# EAGLE design power_supply (EAGLE 9.6.2)
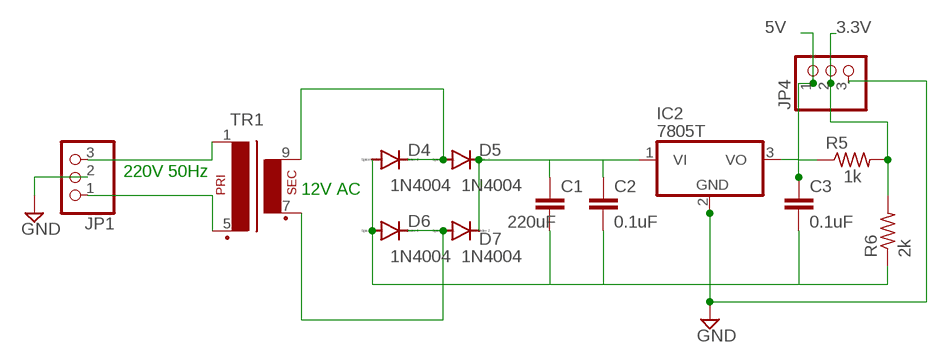
[diagram p0: schematic, sheet 1]

## Parts
C1  220uF  C-EU050-025X075  [C050-025X075]
C2  0.1uF  C-EU050-025X075  [C050-025X075]
C3  0.1uF  C-EU050-025X075  [C050-025X075]
D4  1N4004  [DO41-10]
D5  1N4004  [DO41-10]
D6  1N4004  [DO41-10]
D7  1N4004  [DO41-10]
IC2  7805T  [TO220H]
JP1  PINHD-1X3  [1X03]
JP4  PINHD-1X3  [1X03]
R5  1k  R-US_0207/10  [0207/10]
R6  2k  R-US_0207/10  [0207/10]
TR1  EI30-1  [EI30-1]

## Nets
3.3V: JP4.2 R5.2 R6.2
5V: C3.1 IC2.3(VO) JP4.1 R5.1
GND: C1.2 C2.2 C3.2 D4.A D6.A IC2.2(GND) JP1.2 JP4.3 R6.1
N$8: C1.1 C2.1 D5.C D7.C IC2.1(VI)
N$9: JP1.3 TR1.1
N$12: D4.C D5.A TR1.9(S4)
N$13: D6.C D7.A TR1.7(S3)
N$14: JP1.1 TR1.5(P2)

## Notes on the sheet
- 220V 50Hz
- 12V AC

## Library data of the parts
C1-C3 = rcl:C-EU: CAPACITOR, European symbol; SPICEPREFIX: C
D4-D7 = diode:1N4004: DIODE general purpose rectifier, 1 A
IC2 = linear:78*: Positive VOLTAGE REGULATOR Source: http://cache.national.com/ds/LM/LM78L05.pdf http://www.fairchildsemi.com/ds/LM/LM7805.pdf
JP1 JP4 = pinhead:PINHD-1X3: PIN HEADER
R5 R6 = rcl:R-US_: RESISTOR, American symbol; SPICEPREFIX: R
TR1 = trafo:EI30-1: TRANSFORMER 1 primary winding, 1 secondary winding ERA

## Board
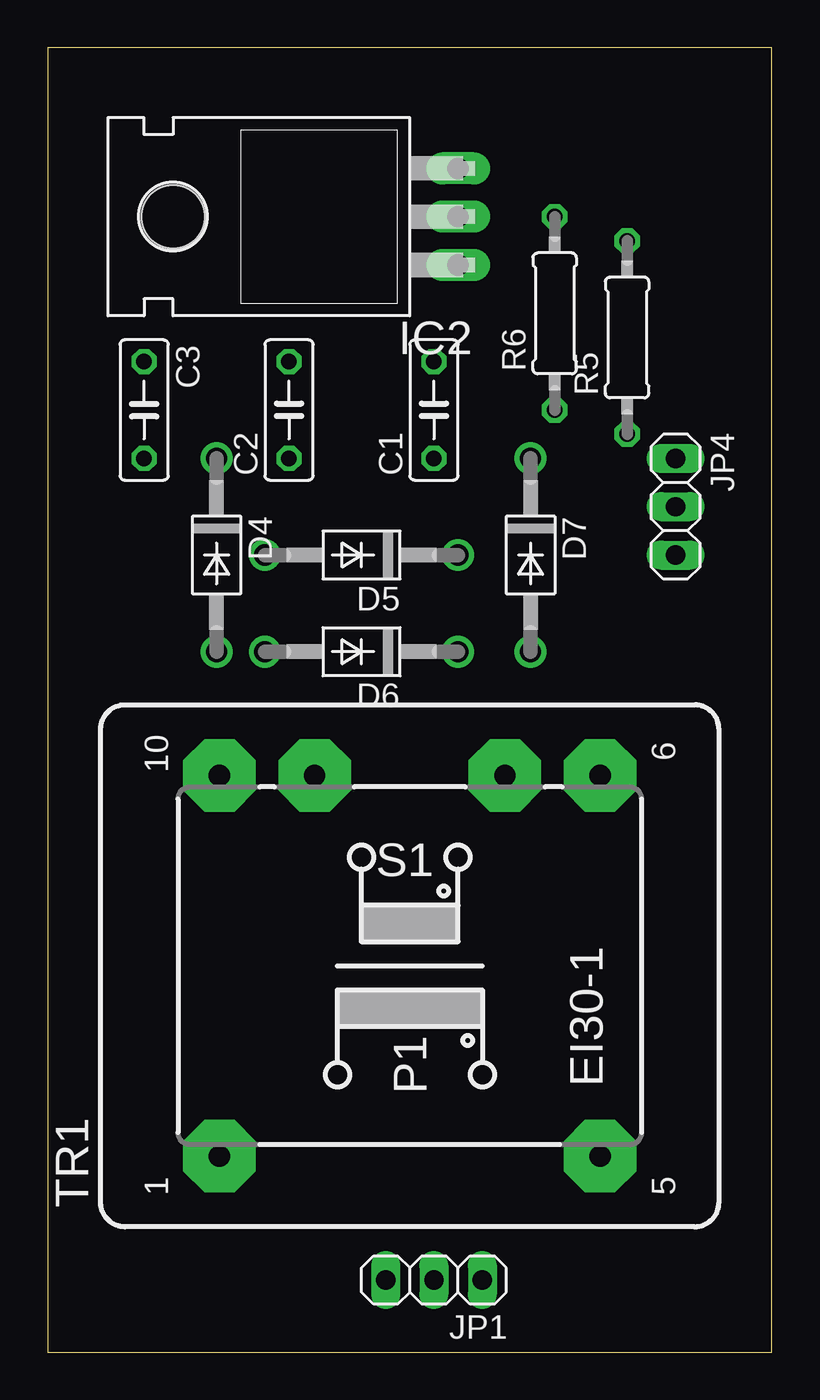
[diagram p1: board, top side]
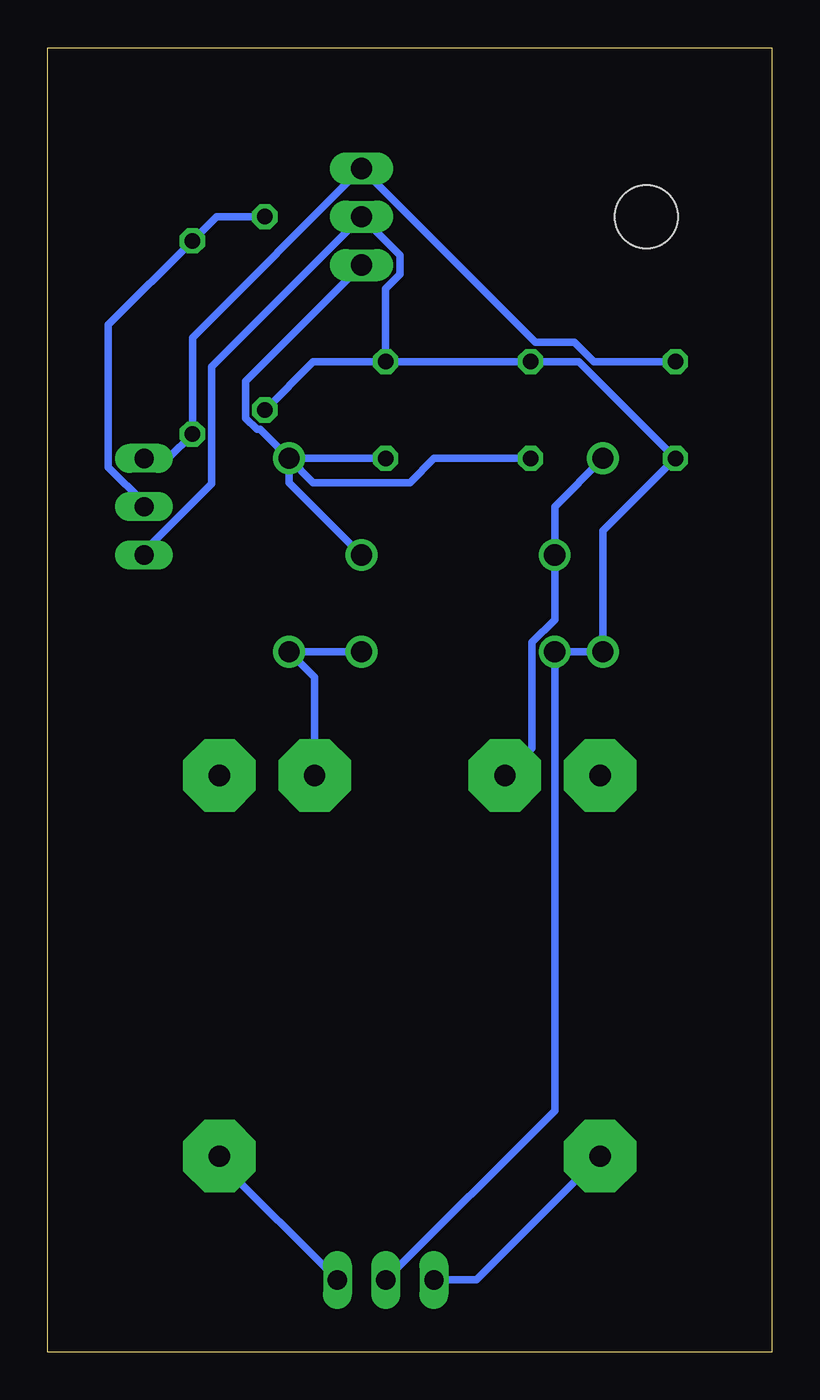
[diagram p2: board, bottom side, seen from below]

Size 38.1 x 68.58 mm. Coordinates in mm from the lower left corner, seen from the top.
Outline: 0,0 38.1,0 38.1,68.58 0,68.58 0,0
Copper layers (1*16): Top 0.035mm / dielectric 1.5mm / Bottom 0.035mm
Design rules "default": minimum track width 6mil, minimum drill 0.35mm, track to track 6mil, track to pad 6mil, pad to pad 6mil, via to via 6mil, smd to smd 6mil, copper to edge 40mil, drill to drill 6mil, minimum pad ring 10mil, minimum via ring 8mil, stop-mask expansion 4mil, vias tented up to drill 0mil, thermal gap 10mil

### Footprints (pad centres in the part's own frame; a part is rotated, then mirrored left to right if it is on the bottom)
C050-025X075 = drill 0.813 octagon: 1 -2.54,0; 2 2.54,0
DO41-10 = drill 1.118: A 5.08,0; C -5.08,0
TO220H = drill 1.118 long: 1 -2.54,-10.16; 2 0,-10.16; 3 2.54,-10.16 | hole 3.302: 0,4.826
1X03 = drill 1.016 long: 1 -2.54,0; 2 0,0; 3 2.54,0
0207/10 = drill 0.813 octagon: 1 -5.08,0; 2 5.08,0
EI30-1 = drill 1.118 pad 3.81 octagon: 1 -10.008,10.008; 5 -10.008,-10.008; 6 10.008,-10.008; 7 10.008,-5.004; 9 10.008,5.004; 10 10.008,10.008

### Placement (x,y rotation side)
C1  20.32,49.53 90 top
C2  12.7,49.53 90 top
C3  5.08,49.53 270 top
D4  8.89,41.91 270 top
D5  16.51,41.91 180 top
D6  16.51,36.83 180 top
D7  25.4,41.91 270 top
IC2  11.43,59.69 90 top
JP1  20.32,3.81 180 top
JP4  33.02,44.45 270 top
R5  30.48,53.34 90 top
R6  26.67,54.61 90 top
TR1  19.05,20.32 90 top

### Tracks (layer width: path | path; a pad name or v marks a point on that pad's centre or on a via)
3.3V
  Bottom 0.406: R6.2 29.21,59.69 R5.2 34.9,54 34.9,46.53 33.02,44.65 JP4.2
5V
  Bottom 0.406: JP4.1 31.75,46.99 R5.1 30.48,53.34 IC2.3 12.45,53.09 10.39,53.09 9.37,52.07 C3.1
GND
  Bottom 0.406: JP1.2 11.43,12.7 D6.A D4.A 8.89,43.18 C3.2 10.16,52.07 C2.2 C1.2 | C1.2 24.13,52.07 R6.1 | JP4.3 33.02,42.11 29.46,45.66 29.46,51.82 IC2.2 19.56,57.66 19.56,56.66 20.32,55.89 C1.2
N$8
  Bottom 0.406: D7.C 25.4,45.72 D5.C | C2.1 17.78,46.99 19.05,45.72 24.13,45.72 D7.C | C1.1 D7.C | IC2.1 27.69,51.05 27.69,49.11 27.09,48.51 26.92,48.51 D7.C
N$9
  Bottom 0.406: TR1.1 15.54,3.81 JP1.3
N$12
  Bottom 0.406: TR1.9 12.62,31.75 12.62,37.32 11.43,38.52 D5.A 11.43,44.45 D4.C
N$13
  Bottom 0.406: TR1.7 24.05,35.48 D7.A D6.C
N$14
  Bottom 0.406: JP1.1 29.06,10.01 TR1.5